# EAGLE board LM_180622 (EAGLE 7.7.1), part 1 of 2
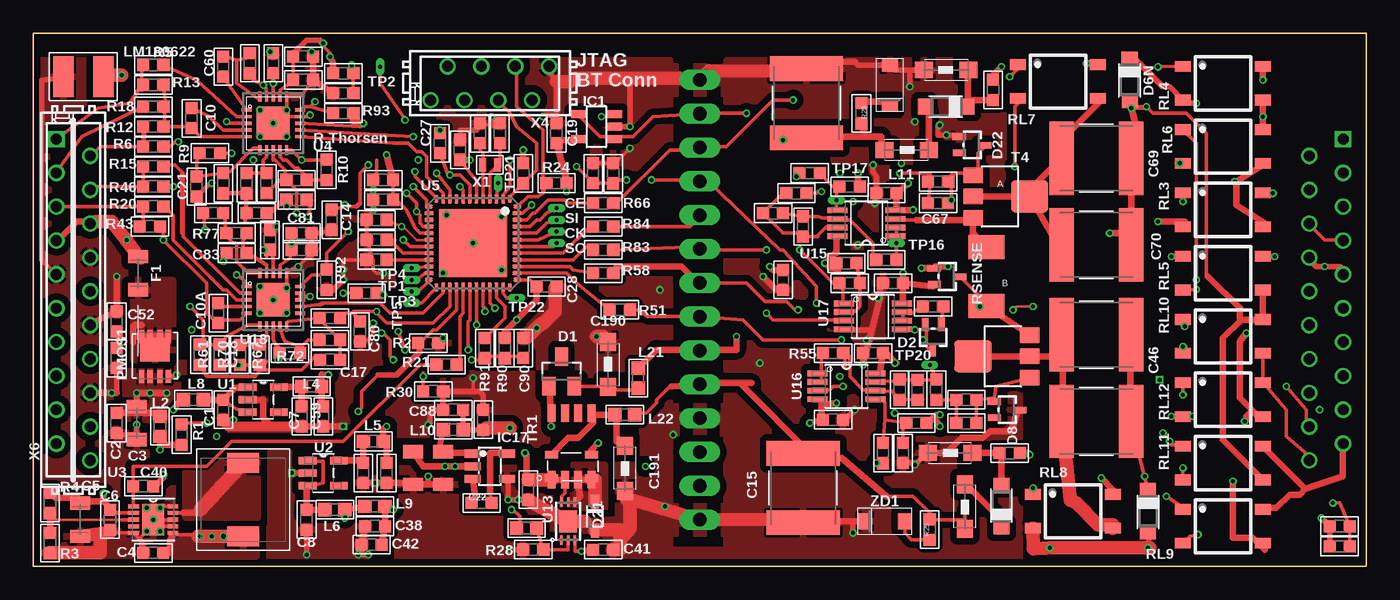
[diagram p6: board, top side]
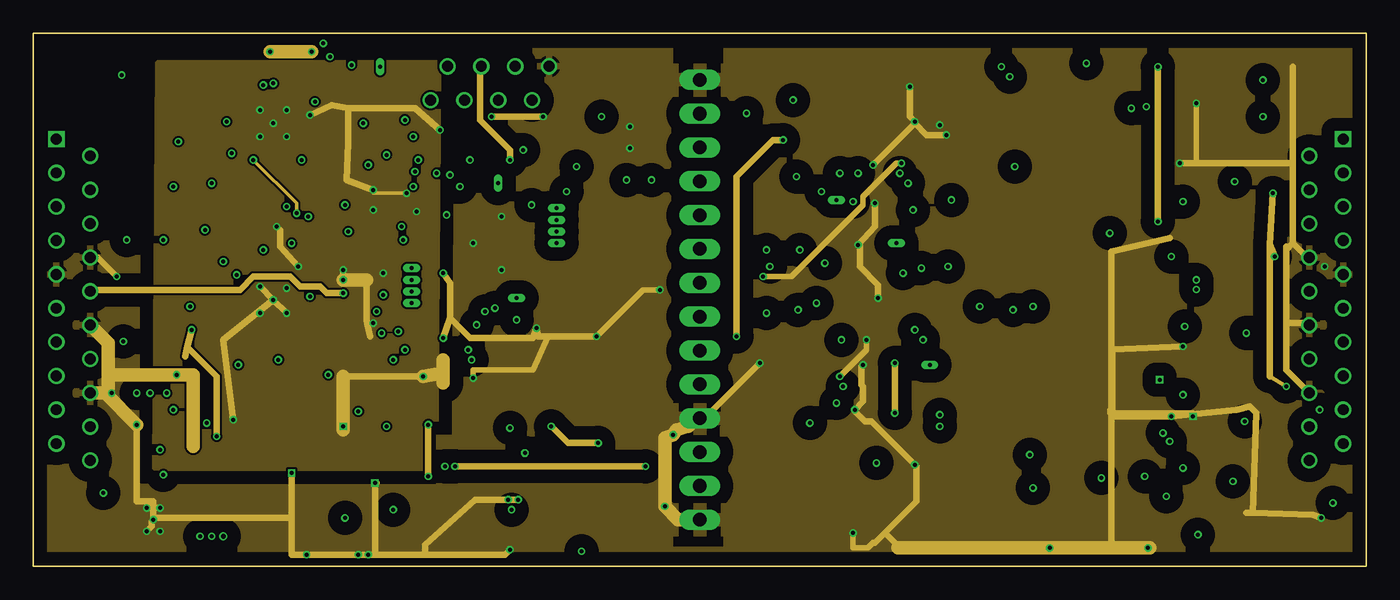
[diagram p7: board, inner layer gnd]
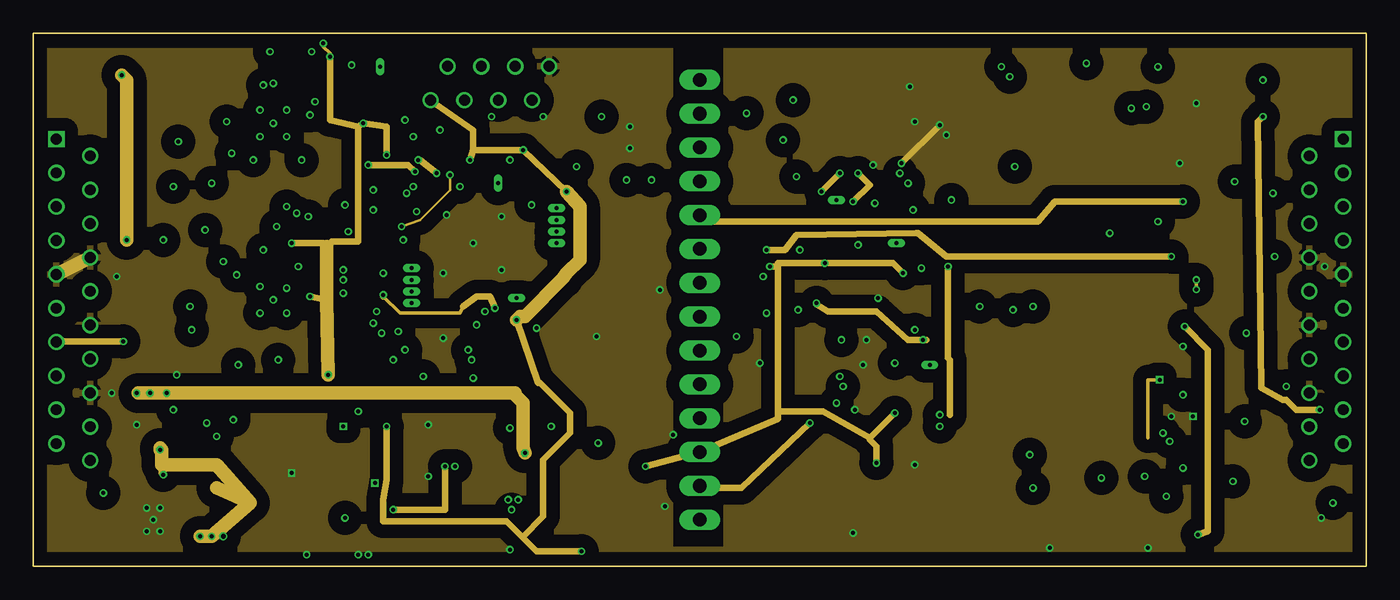
[diagram p8: board, inner layer pwr]
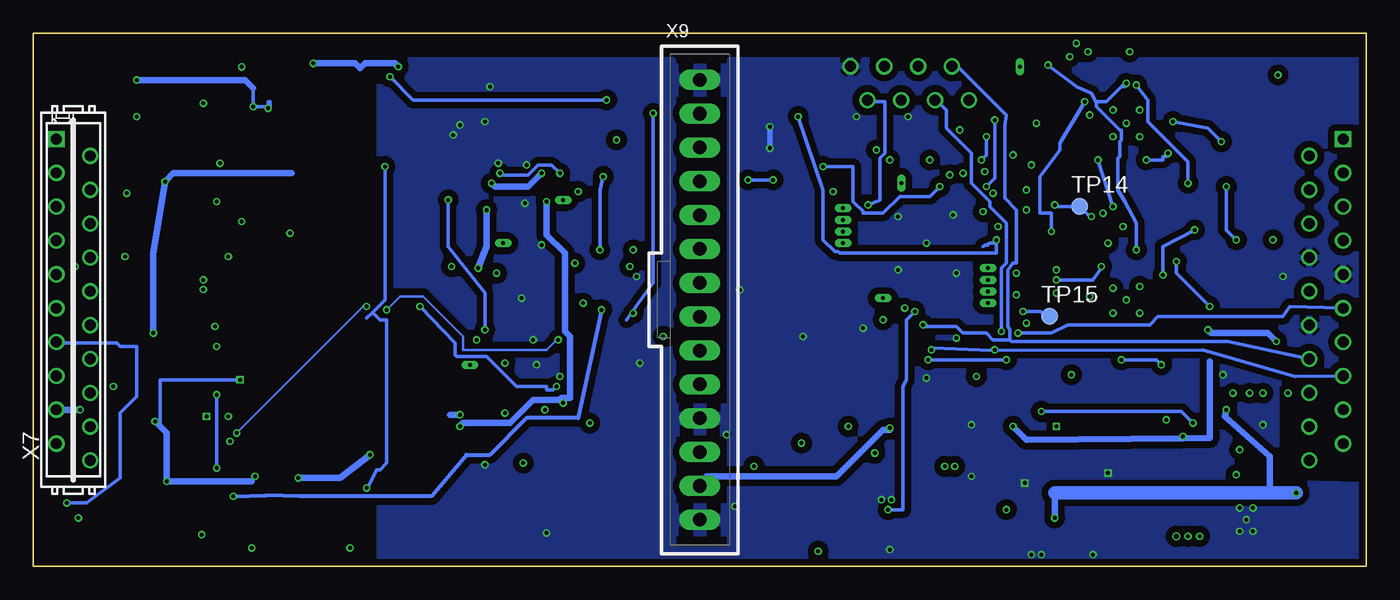
[diagram p9: board, bottom side, seen from below]

Size 100 x 40 mm. Coordinates in mm from the lower left corner, seen from the top.
Outline: 0,40 100,40 100,0 0,0 0,40
Copper layers (1+2*3+16): Top 0.018mm / dielectric 0.2mm / gnd 0.035mm / dielectric 0.36mm / pwr 0.035mm / dielectric 0.3mm / Bottom 0.018mm
Design rules "eC_6Layer_PClass6_BaseCopperO18-I35_eCDefault *": minimum track width 0.15mm, minimum drill 0.3mm, track to track 0.15mm, track to pad 0.15mm, pad to pad 0.15mm, via to via 0.15mm, smd to smd 0mil, copper to edge 0.25mm, drill to drill 0.35mm, minimum pad ring 0.175mm, minimum via ring 0.125mm, stop-mask expansion 0mil, vias tented up to drill 0.45mm, thermal gap 0.2mm
Net classes: 0 default: width 0.25 mm, drill 0.3 mm, clearance 0.15 mm; 1 pwr: width 0.5 mm, drill 0.3 mm, clearance 0.2 mm to class 0, clearance 0.2 mm; 2 cHVP: width 0.5 mm, drill 0.3 mm, clearance 0.4 mm to class 0, clearance 0.4 mm to class 1, clearance 0.25 mm; 3 cVHN: width 0.5 mm, drill 0.3 mm, clearance 0.4 mm to class 0, clearance 0.4 mm to class 1, clearance 0.8 mm to class 2, clearance 0.25 mm; 4 cHV: width 0.25 mm, drill 0.3 mm, clearance 0.8 mm to class 0, clearance 0.8 mm to class 1, clearance 0.8 mm to class 2, clearance 0.8 mm to class 3, clearance 0.8 mm; 5 cPPLS: width 0.5 mm, drill 0.3 mm, clearance 0.4 mm to class 0, clearance 0.4 mm to class 1, clearance 0.8 mm to class 2, clearance 0.8 mm to class 3, clearance 0.4 mm to class 4, clearance 0.25 mm; 6 cNPLS: width 0.5 mm, drill 0.3 mm, clearance 0.4 mm to class 0, clearance 0.4 mm to class 1, clearance 0.8 mm to class 2, clearance 0.8 mm to class 3, clearance 0.4 mm to class 4, clearance 0.4 mm to class 5, clearance 0.25 mm; 7 cGnd: width 0.4 mm, drill 0.2 mm, clearance 0.2 mm to class 0, clearance 0.2 mm to class 1, clearance 0.2 mm to class 2, clearance 0.2 mm to class 3, clearance 0.2 mm to class 4, clearance 0.2 mm to class 5, clearance 0.2 mm to class 6; 8 signal: width 0.2 mm, drill 0.3 mm, clearance 0.2 mm to class 0, clearance 0.25 mm to class 1, clearance 0.8 mm to class 2, clearance 0.8 mm to class 3, clearance 0.8 mm to class 4, clearance 0.8 mm to class 5, clearance 0.8 mm to class 6, clearance 0.2 mm to class 7, clearance 0.2 mm
vRestrict: area 1.1,7.1 to 4.9,12.2

## Footprints (pad centres in the part's own frame; a part is rotated, then mirrored left to right if it is on the bottom)
C0603 = smd 0.9 x 0.9: 1 -0.75,0; 2 0.75,0
C0805 = smd 1 x 1.5: 1 -1.25,0; 2 1.25,0
C2220K = smd 1.85 x 5.5: 1 -2.6,0; 2 2.6,0
0603-CAP = smd 0.9 x 0.9: 1 -0.75,0; 2 0.75,0
C0805' = smd 1 x 1.5: 1 -1.35,0; 2 1.1,0
1206 = smd 1.35 x 1.2: 1 -1.7,0; 2 1.65,0
C1210 = smd 1.55 x 3.1: 1 -1.5,0; 2 1.5,0
TH0305 = drill 0.3 pad 0.5 long: TP 0,0
SOT23 = smd 1 x 1.4: 1 -0.95,-1.1; 2 0.95,-1.1; 3 0,1.1
SOT323 = smd 0.5 x 1: 1 -0.625,-0.925; 2 0.6,-0.9; 3 0.025,1
SOD123 = smd 0.95 x 1.2: A 1.638,0 | smd 0.95 x 1.21: C -1.638,0
SOD323 = smd 1 x 0.6: A 1.1,0; K -1.1,0
SOT23-5 = smd 0.6 x 1.2: 1 -0.95,-1.306; 2 0,-1.306; 3 0.95,-1.306; 4 0.95,1.306; 5 -0.95,1.306
SOT23-5' = smd 0.62 x 1.22: 1 -0.95,-1.3; 2 0,-1.3; 3 0.95,-1.3; 4 0.95,1.3; 5 -0.95,1.3
SMT_POWER_IND_B82462G4 = smd 1.5 x 2.4: 1 -2.75,0; 2 2.75,0
L0603 = smd 1 x 1: 1 -0.75,0; 2 0.75,0
POWERPAK1212-8SINGLE = smd 1.727 x 2.235: D0 0.5,0 | smd 1 x 0.4: D1 1.5,1; D2 1.5,0.375; D3 1.5,-0.375; D4 1.5,-1; G -1.5,-1; S1 -1.5,1; S2 -1.5,0.375; S3 -1.5,-0.375
R0603 = smd 0.914 x 0.914: 1 -0.762,0; 2 0.762,0
SOP04 = smd 0.8 x 1.2: 1 -1.27,-3; 2 1.27,-3; 3 1.27,3; 4 -1.27,3
R2010 = smd 1.8 x 2.7: 1 -2.223,0; 2 2.223,0
SOT89 = smd 1.2 x 1.5: 1 -1.6,-1.75; 2 0,-1.75; 3 1.6,-1.75 | smd 2.4 x 2.8: 4 0,2.5
B1,27 = smd 1.27 x 1.27: TP 0,0
3225_4PIN = smd 1 x 0.55: 1 -1.5,-0.875; 2 -1.5,0.875; 3 1.5,0.875; 4 1.5,-0.875
SM-E6 = smd 1.3 x 0.6: 1 2.5,0; 2 2.5,1; 3 2.5,2; 4 2.5,3; 5 -2.5,3; 6 -2.5,2; 7 -2.5,1; 8 -2.5,0
SOT95P280X100-5N = smd 1.321 x 0.559: 1 -1.168,0.94; 2 -1.168,0; 3 -1.168,-0.94; 4 1.168,-0.94; 5 1.168,0.94
SON50P300X300X100-11N = smd 0.813 x 0.305: 1 -1.473,0.991; 2 -1.473,0.508; 3 -1.473,0; 4 -1.473,-0.508; 5 -1.473,-0.991; 6 1.473,-0.991; 7 1.473,-0.508; 8 1.473,0; 9 1.473,0.508; 10 1.473,0.991 | smd 1.651 x 2.388: 11 0,0
LFCSP_20 = smd 0.75 x 0.25: 1 -2,1; 2 -2,0.5; 3 -2,0; 4 -2,-0.5; 5 -2,-1; 11 2,-1; 12 2,-0.5; 13 2,0; 14 2,0.5; 15 2,1 | smd 0.25 x 0.75: 6 -1,-2; 7 -0.5,-2; 8 0,-2; 9 0.5,-2; 10 1,-2; 16 1,2; 17VS 0.5,2; 18 0,2; 19 -0.5,2; 20 -1,2 | smd 2.5 x 2.5: PAD 0,0
LFCSP48 = smd 0.6 x 0.32: 1 -3.325,2.75; 12 -3.325,-2.75; 25 3.325,-2.75; 36 3.325,2.75 | smd 0.7 x 0.32: 2 -3.3,2.25; 3 -3.3,1.75; 4 -3.3,1.25; 5 -3.3,0.75; 6 -3.3,0.25; 7 -3.3,-0.25; 8 -3.3,-0.75; 9 -3.3,-1.25; 10 -3.3,-1.75; 11 -3.3,-2.25; 26 3.3,-2.25; 27 3.3,-1.75; 28 3.3,-1.25; 29 3.3,-0.75; 30 3.3,-0.25; 31 3.3,0.25; 32 3.3,0.75; 33 3.3,1.25; 34 3.3,1.75; 35 3.3,2.25 | smd 0.32 x 0.6: 13 -2.75,-3.325; 24 2.75,-3.325; 37 2.75,3.325; 48 -2.75,3.325 | smd 0.32 x 0.7: 14 -2.25,-3.3; 15 -1.75,-3.3; 16 -1.25,-3.3; 17 -0.75,-3.3; 18 -0.25,-3.3; 19 0.25,-3.3; 20 0.75,-3.3; 21 1.25,-3.3; 22 1.75,-3.3; 23 2.25,-3.3; 38 2.25,3.3; 39 1.75,3.3; 40 1.25,3.3; 41 0.75,3.3; 42 0.25,3.3; 43 -0.25,3.3; 44 -0.75,3.3; 45 -1.25,3.3; 46 -1.75,3.3; 47 -2.25,3.3 | smd 5.1 x 5.1: EXP 0,0
DFN6-2X3 = smd 0.25 x 0.7: 1 -0.5,-1.425; 2 0,-1.425; 3 0.5,-1.425; 4 0.5,1.425; 5 0,1.425; 6 -0.5,1.425 | smd 1.35 x 1.65: EXP 0,0
MSOP8 = smd 1.499 x 0.432: 1 -2.184,0.965; 2 -2.184,0.33; 3 -2.184,-0.33; 4 -2.184,-0.965; 5 2.184,-0.965; 6 2.184,-0.33; 7 2.184,0.33; 8 2.184,0.965
CRYSTAL-2PIN = smd 0.5 x 1: 1 -0.55,0; 2 0.55,0
MICROMATCH-8 = drill 0.813: 1 4.445,1.27; 2 3.175,-1.27; 3 1.905,1.27; 4 0.635,-1.27; 5 -0.635,1.27; 6 -1.905,-1.27; 7 -3.175,1.27; 8 -4.445,-1.27
MICROMATCH-20 = drill 0.813 square: 1 12.065,1.27 | drill 0.813: 2 10.795,-1.27; 3 9.525,1.27; 4 8.255,-1.27; 5 6.985,1.27; 6 5.715,-1.27; 7 4.445,1.27; 8 3.175,-1.27; 9 1.905,1.27; 10 0.635,-1.27; 11 -0.635,1.27; 12 -1.905,-1.27; 13 -3.175,1.27; 14 -4.445,-1.27; 15 -5.715,1.27; 16 -6.985,-1.27; 17 -8.255,1.27; 18 -9.525,-1.27; 19 -10.795,1.27; 20 -12.065,-1.27
70543-14 = drill 1.016 long: 1 -16.51,0; 2 -13.97,0; 3 -11.43,0; 4 -8.89,0; 5 -6.35,0; 6 -3.81,0; 7 -1.27,0; 8 1.27,0; 9 3.81,0; 10 6.35,0; 11 8.89,0; 12 11.43,0; 13 13.97,0; 14 16.51,0
SOD123' = smd 1 x 1.2: 1C -1.5,0; 2A 1.5,0

## Placement (x,y rotation side)
C1  10uF  [C0603]  14.25,11.75 90 top
C1U15  100nF  [C0603]  56.25,21.5 90 top
C1U16  100nF  [C0603]  60,11 0 top
C2  10uF  [C0603]  6.25,10.75 90 top
C2U15  100nF  [C0603]  64,28 180 top
C2U16  100nF  [C0603]  63,16 0 top
C3  47uF  [C0805]  7.75,10.75 90 top
C4  10uF  [C0603]  9,1 0 top
C5  47uF  [C0805]  3.5,3.5 90 top
C6  10uF  [C0603]  5.75,3.5 90 top
C7  10uF  [C0603]  20.12,11.25 90 top
C8  10uF  [C0603]  20.5,3.5 90 top
C9  10uF  [C0603]  24.75,7 90 top
C10  1nF  [C0603]  11.88,33.62 90 top
C10A  1nF  [C0603]  13.88,19 90 top
C11  33nF  [C0603]  16.75,26.5 0 top
C12  33nF  [C0603]  17.5,28.75 90 top
C13  2u2  [C2220K]  58,34.75 270 top
C14  100nF  [C0603]  22.38,26 270 top
C15  2u2  [C2220K]  57.75,5.88 90 top
C16  10uF  [C0603]  20.25,36.5 180 top
C17  33nF  [C0603]  22.25,15.5 0 top
C18  33nF  [C0603]  15.5,15.88 90 top
C19  100nF  [C0603]  39.25,32.5 90 top
C20  100nF  [C0603]  20.25,38.25 0 top
C21  220nF  [C0603]  12.25,28.5 90 top
C22  1uF  [0603-CAP]  33.62,4.75 0 top
C23  100nF  [C0603]  18,37.75 90 top
C24  100nF  [C0603]  32,31.25 90 top
C26  470nF  [C0603]  25.75,26 180 top
C27  470nF  [C0603]  30.5,31.75 90 top
C28  100nF  [C0603]  38.5,21 0 top
C29  10uF  [C0603]  26.5,7 90 top
C30  10uF  [C0603]  26.25,27.5 0 top
C31  100nF  [C0603]  26.25,29 180 top
C32  10pF  [C0603]  33.5,32.5 270 top
C33  10pF  [C0603]  35,32.5 270 top
C34  470nF  [C0603]  25.75,24.5 180 top
C38  10uF  [C0603]  25.62,3 0 top
C39  4.7uF  [C0603]  37.12,5.75 90 top
C40  100nF  [C0603]  8.25,6 0 top
C41  100nF  [C0603]  42.75,1.25 0 top
C42  100nF  [C0603]  25.38,1.62 180 top
C43  4u7F  [C0805']  30.75,7.25 270 top
C44  100nF  [1206]  68.5,37.25 0 top
C45  100nF  [C0603]  70,12.5 0 top
C46  2u2  [C2220K]  79.75,17.38 0 top
C47  4u7F  [C0805']  28.5,7.25 270 top
C48  100nF  [C0603]  6.25,15.62 270 top
C49  100nF  [C0603]  42,29.5 90 top
C50  100nF  [1206]  68.75,8.5 180 top
C51  2u2  [C2220K]  79.75,10.88 0 top
C52  10uF  [C0603]  6.25,18.38 270 top
C53  100nF  [C0603]  98,3 0 top
C54  10uF  [C0603]  98,1.5 180 top
C55  100uF  [C1210]  3.75,36.75 0 top
C58  10uF  [C0603]  33.75,11 270 top
C59  10uF  [C0603]  21.75,11.25 90 top
C60  220nF  [C0603]  14.25,37.5 90 top
C67  100nF  [C0603]  67.88,27.25 0 top
C69  2u2  [C2220K]  79.75,30.62 180 top
C70  2u2  [C2220K]  79.75,24.12 180 top
C75  100PF  [C0603]  55.5,26.5 180 top
C76  100PF  [C0603]  66.35,13.25 90 top
C80  100nF  [C0603]  24.5,17.62 270 top
C81  10uF  [C0603]  20.12,25 180 top
C82  100nF  [C0603]  20.12,23.75 0 top
C83  220nF  [C0603]  15.25,23.5 180 top
C85  220nF  [C0603]  13.5,26.5 0 top
C86  100nF  [C0603]  17.75,24.5 90 top
C88  100nF  [C0603]  31.5,11.75 180 top
C90  100nF  [C0603]  36.75,16.38 270 top
C144  100nF  [C0603]  65.25,8.5 90 top
C190  100nF  [1206]  43.12,15.12 270 top
C191  100nF  [1206]  44.38,7.38 90 top
CE  NM  [TH0305]  39.25,26.88 180 top
CK  NM  [TH0305]  39.25,25.12 180 top
CU17  100nF  [C0603]  64.5,21.25 0 top
D1  BAV23S  [SOT23]  39.62,14.62 0 top
D2  BAS40-04W  [SOT323]  67.5,17.25 180 top
D6N  BAV3004W-7-F  [SOD123]  82.25,36.5 270 top
D6P  BAV3004W-7-F  [SOD123]  83.62,4.12 270 top
D6P1  BAV3004W-7-F  [SOD123]  68.5,34.5 180 top
D6P2  BAV3004W-7-F  [SOD123]  72.62,4.5 90 top
D8  BAS40-04W  [SOT323]  73,11.75 270 top
D12  BAS40-04W  [SOT323]  68.5,21.75 270 top
D21  ZHCS400  [SOD323]  42.12,3.75 270 top
D22  BAS40-04W  [SOT323]  70.38,31.62 270 top
F1  FUSE_1A  [C0805]  7.88,22 270 top
IC1  OPA340N  [SOT23-5]  42.25,33 90 top
IC17  TPS60400  [SOT23-5']  34.25,7.5 270 top
L1  6U8  [SMT_POWER_IND_B82462G4]  15.75,5 90 top
L2  330  [L0603]  9.5,10.5 270 top
L3  330  [L0603]  37,2.88 180 top
L4  330  [L0603]  20.88,13.5 0 top
L5  330  [L0603]  25.5,9.38 0 top
L6  330  [L0603]  22.62,4.25 180 top
L8  330  [L0603]  12,12.5 0 top
L9  330  [L0603]  25.62,4.5 0 top
L10  330  [L0603]  31.5,10.25 0 top
L11  47uH  [1206]  65.5,31.25 180 top
L12  47uH  [1206]  69.88,4.5 90 top
L21  330  [L0603]  45.38,14.12 90 top
L22  330  [L0603]  44.38,11.38 0 top
PMOS1  SIS407DN  [POWERPAK1212-8SINGLE]  9.12,15.75 90 top
R1  2M  [R0603]  11.12,9.88 270 top
R2  390k  [R0603]  29.62,16.75 180 top
R3  270k  [R0603]  1.25,1.75 90 top
R4  2M  [R0603]  1.25,4.75 90 top
R5  180k  [R0603]  9,37.62 0 top
R6  180k  [R0603]  9,31.5 0 top
R7  10K  [R0603]  14.25,28.75 270 top
R8  10K  [R0603]  16,28.75 90 top
R9  100k  [R0603]  13.25,31 0 top
R10  100k  [R0603]  22,29.75 270 top
R11  100k  [R0603]  19.75,29 180 top
R12  10M  [R0603]  9,33 0 top
R13  10M  [R0603]  9,36.12 0 top
R14  3K3  [R0603]  19.75,27.5 0 top
R15  180k  [R0603]  9,30 0 top
R16  10M  [R0603]  23.25,35.5 0 top
R17  10M  [R0603]  23.25,37 180 top
R18  499k  [R0603]  9,34.5 180 top
R19  470R  [R0603]  25,20.5 0 top
R20  180k  [R0603]  9,27 0 top
R21  10K  [R0603]  31,15.12 0 top
R22  10M  [R0603]  16.25,37.75 270 top
R23  1k  [R0603]  62.12,34 270 top
R24  100k  [R0603]  39.25,28.75 0 top
R25  1k  [R0603]  67.25,2.75 90 top
R26  N.M. (150k)  [R0603]  25.75,23 0 top
R28  1M  [R0603]  37.5,1.25 0 top
R29  1k  [R0603]  57.25,28 180 top
R30  0R  [R0603]  30,13.12 0 top
R40  1M  [R0603]  67.88,28.88 180 top
R41  1k  [R0603]  67.75,13.25 90 top
R42  1M  [R0603]  70,10.75 180 top
R43  10M  [R0603]  8.75,25.5 0 top
R46  10M  [R0603]  9,28.5 0 top
R48  10R  [R0603]  72,35.75 270 top
R49  10R  [R0603]  73.25,8.5 180 top
R51  820R  [R0603]  44,19.25 0 top
R55  1k  [R0603]  60,16 0 top
R56  100k  [R0603]  65,13.25 270 top
R57  100k  [R0603]  57.75,25.5 90 top
R58  820R  [R0603]  42.75,22 0 top
R61  10K  [R0603]  12.5,15.88 270 top
R62  1M  [R0603]  43.5,29.5 270 top
R63  1k  [R0603]  64,23 180 top
R64  4k7  [R0603]  58.25,29.5 0 top
R65  100k  [R0603]  61.25,28.5 180 top
R66  390R  [R0603]  42.75,27.25 180 top
R67  10K  [R0603]  17,15.88 90 top
R68  100k  [R0603]  61,22.75 180 top
R69  100k  [R0603]  61.25,21.25 0 top
R70  100k  [R0603]  14,15.88 270 top
R71  100k  [R0603]  22.25,17 180 top
R72  100k  [R0603]  19.25,16 180 top
R73  3K3  [R0603]  22.25,18.62 0 top
R77  10M  [R0603]  15.25,25 0 top
R80  1k  [R0603]  67.5,19.5 180 top
R83  820R  [R0603]  42.75,23.75 0 top
R84  820R  [R0603]  42.75,25.5 0 top
R89  10K  [R0603]  36.75,29.5 270 top
R90  390k  [R0603]  35.38,16.38 90 top
R91  390k  [R0603]  33.88,16.38 270 top
R92  NM  [R0603]  22,21.5 90 top
R93  10K  [R0603]  23.25,34 0 top
R144  10M  [R0603]  66.25,10.75 0 top
R145  10M  [R0603]  63.75,8.5 90 top
RL3  AQY210S  [SOP04]  89.25,26.75 270 top
RL4  AQY210S  [SOP04]  89.25,36.25 270 top
RL5  AQY210S  [SOP04]  89.25,22 270 top
RL6  AQY210S  [SOP04]  89.25,31.5 270 top
RL7  AQY210S  [SOP04]  76.88,36.38 270 top
RL8  AQY210S  [SOP04]  78,4.12 270 top
RL9  AQY210S  [SOP04]  89.25,3 270 top
RL10  AQY210S  [SOP04]  89.25,17.25 270 top
RL11  AQY210S  [SOP04]  89.25,7.75 270 top
RL12  AQY210S  [SOP04]  89.25,12.5 270 top
RSENSE  20R  [R2010]  71.5,21.75 90 top
SI  NM  [TH0305]  39.25,26 180 top
SO  NM  [TH0305]  39.25,24.25 180 top
T4  ZVN4525ZTA  [SOT89]  72.25,27.75 270 top
T25  ZVP4525ZTA  [SOT89]  73,15.75 90 top
TP1  NM  [TH0305]  28.38,21.5 0 top
TP2  NM  [TH0305]  26,37.5 90 top
TP3  NM  [TH0305]  28.38,20.62 0 top
TP4  NM  [TH0305]  28.38,22.38 0 top
TP5  NM  [TH0305]  28.38,19.75 0 top
TP14  NM  [B1,27]  21.5,27 0 bottom
TP15  NM  [B1,27]  23.75,18.75 0 bottom
TP16  NM  [TH0305]  64.75,24.25 0 top
TP17  NM  [TH0305]  60.25,27.5 180 top
TP20  NM  [TH0305]  67.25,15.12 180 top
TP21  NM  [TH0305]  34.88,28.75 90 top
TP22  NM  [TH0305]  36.25,20.12 180 top
TR1  ATB322524-0110-T000  [3225_4PIN]  40.38,7.5 0 top
TR1A  NM (LDT565630T-001)  [SM-E6]  41.88,9 90 top
U1  ADP160AUJZ-3.3-R7  [SOT95P280X100-5N]  17.25,12.5 0 top
U2  ADP160AUJZ-3.3-R7  [SOT95P280X100-5N]  21.75,7 0 top
U3  TPS61020DRCRG4  [SON50P300X300X100-11N]  9,3.5 0 top
U4  AD8232  [LFCSP_20]  18,33.25 0 top
U5  ADUCM360BCPZ128  [LFCSP48]  33,24.25 270 top
U13  LT3484-2  [DFN6-2X3]  40.12,3.38 0 top
U15  AD8642ARMZ  [MSOP8]  62.5,25.75 180 top
U16  AD8642ARMZ  [MSOP8]  61,13.5 0 top
U17  AD8642ARMZ  [MSOP8]  63,18.75 0 top
U18  AD8232  [LFCSP_20]  18,20 0 top
X1  ABS05-32.768KHZ  [CRYSTAL-2PIN]  34.25,30.12 180 top
X4  MICROMATCH-8  [MICROMATCH-8]  34.25,36.25 180 top
X6  MICROMATCH-20  [MICROMATCH-20]  3,20 90 top
X7  nm  [MICROMATCH-20]  97,20 90 bottom
X9  NM  [70543-14]  50,20 270 bottom
ZD1  KDZLVTFTR150  [SOD123']  63.88,3.38 0 top
ZD3  KDZLVTFTR150  [SOD123']  64.25,36.12 90 top